# Altium project FIT_PM_Dual_Range_AFE.PrjPcb (part 5 of 8)

## Sheet ADC_PLL.SchDoc: FIT_PM12 board
size 420 x 297 mm; CheckedBy: G.Kasprowicz; Author: INR Moscow; CompanyName: WUT ISE; DrawnBy: M.Podgórski; Organization: WUT ISE; Address1: PW ISE; Address2: Nowowiejska 15/19 00-665 Warsaw; Address3: gkasprow@gmail.com; DocumentNumber: 6; Revision: 2; SheetNumber: 7; SheetTotal: 21; ModifiedBy: -; CheckedDate: -; Title2: ADC clocking; DivGrp: WUT ISE; Designer: INR RAS; ModifiedDate: -; ProjectName: Sensor Box
Used 2 times, as channels U_AFE/ADC_PLL1, U_AFE/ADC_PLL2. Parts and nets are listed once, with the designators drawn on the sheet.
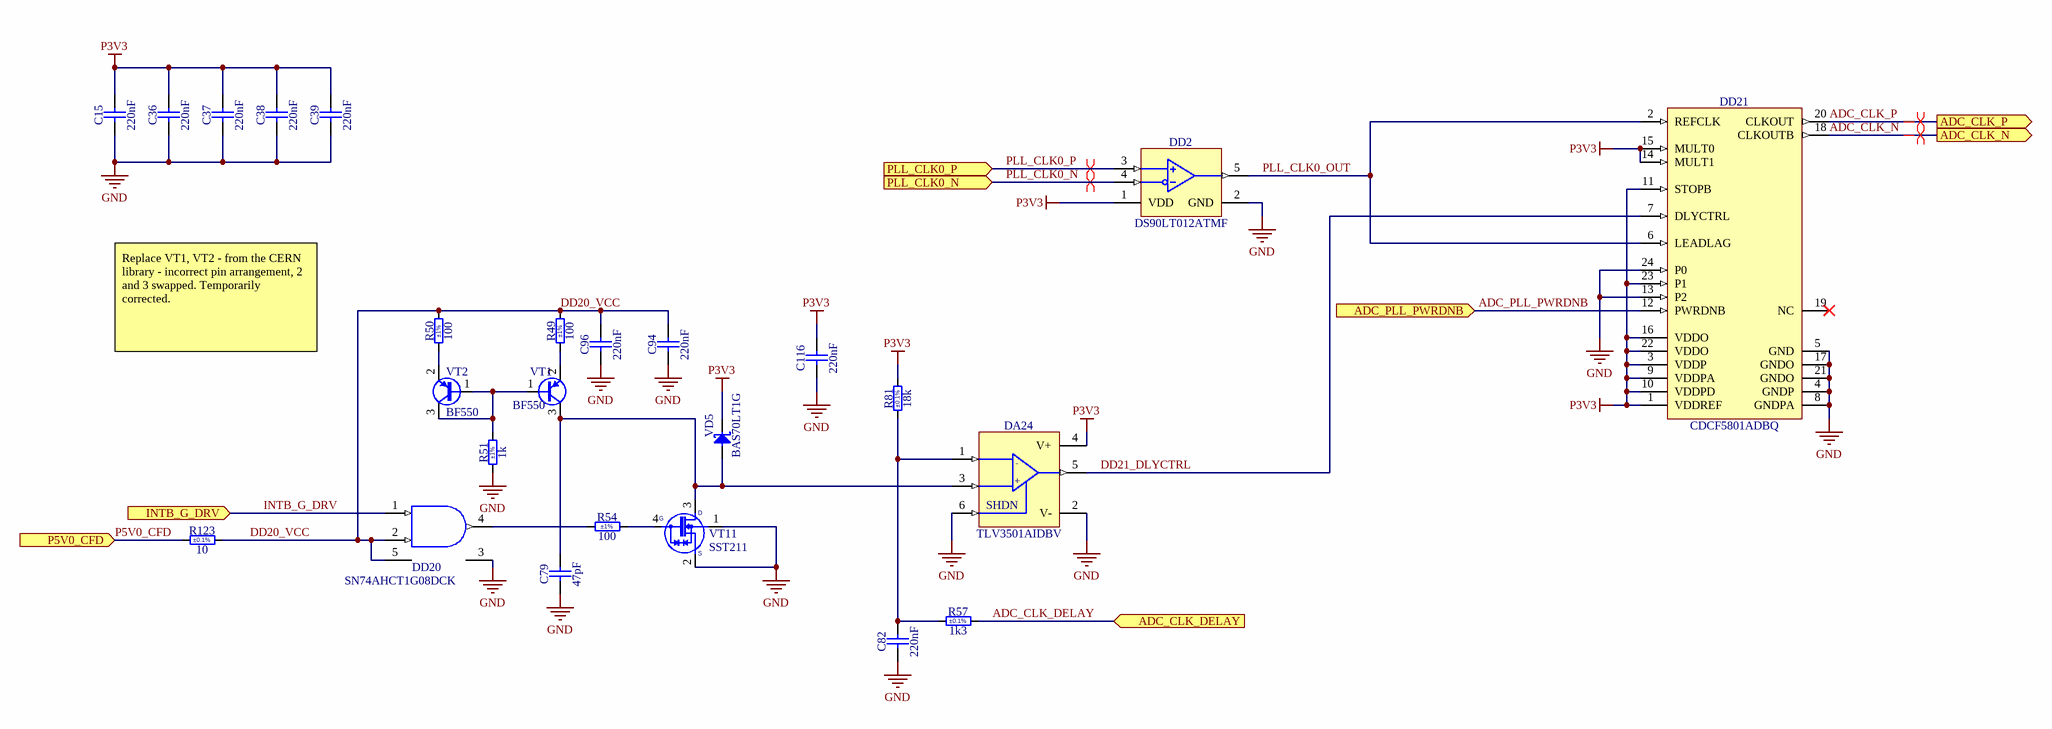
[diagram p15: ADC_PLL.SchDoc]

### Parts
C15  220nF  [CAPC1005X55N]
C36  220nF  [CAPC1005X55N]
C37  220nF  [CAPC1005X55N]
C38  220nF  [CAPC1005X55N]
C39  220nF  [CAPC1005X55N]
C79  47pF  [CAPC2012X140N]
C82  220nF  [CAPC1005X55N]
C94  220nF  [CAPC1005X55N]
C96  220nF  [CAPC1005X55N]
C116  220nF  [CAPC2012X135N]
DA24  TLV3501AIDBV  [SOT95P280X145-6N]
DD2  DS90LT012ATMF  [SOT95P280X145-5N]
DD20  SN74AHCT1G08DCK  [SOT65P210X110-5N]
DD21  CDCF5801ADBQ  [SOP63P600X175-24N]
R49  100  Tolerance: ±1%  [RESC1608X55N]
R50  100  Tolerance: ±1%  [RESC1608X55N]
R51  1k  Tolerance: ±1%  [RESC1005X40N]
R54  100  Tolerance: ±1%  [RESC1608X55N]
R57  1k3  Tolerance: ±0.1%  [RESC2012X60N]
R81  18k  Tolerance: ±0.1%  [RESC2012X60N]
R123  10  Tolerance: ±0.1%  [RESC2012X60N]
VD5  BAS70LT1G  [SOT95P240X110-3N]
VT1  BF550  [SOT95P230X110-3N]
VT2  BF550  [SOT95P230X110-3N]
VT11  SST211  [SOT143N]

### Ports
ADC_CLK_DELAY (in), ADC_CLK_N (out), ADC_CLK_P (out), ADC_PLL_PWRDNB (in), INTB_G_DRV (in), P5V0_CFD (in), PLL_CLK0_N (in), PLL_CLK0_P (in)

### Nets
GND: C15.1 C36.1 C37.1 C38.1 C39.1 C79.1 C82.1 C94.1 C96.1 C116.1 DA24.2(V-) DA24.6(SHDN) DD2.2(GND) DD20.3(GND) DD21.4(GNDP) DD21.5(GND) DD21.8(GNDPA) DD21.13(P2) DD21.17(GNDO) DD21.21(GNDO) DD21.24(P0) R51.1 VT11.1(SUB) VT11.2(S)
P3V3: C15.2 C36.2 C37.2 C38.2 C39.2 C116.2 DA24.4(V+) DD2.1(VDD) DD21.1(VDDREF) DD21.3(VDDP) DD21.9(VDDPA) DD21.10(VDDPD) DD21.11(STOPB) DD21.14(MULT1) DD21.15(MULT0) DD21.16(VDDO) DD21.22(VDDO) DD21.23(P1) R81.2 VD5.3(C)
ADC_CLK_DELAY: R57.2 ; port ADC_CLK_DELAY
ADC_CLK_N: DD21.18(CLKOUTB) ; port ADC_CLK_N
ADC_CLK_P: DD21.20(CLKOUT) ; port ADC_CLK_P
ADC_PLL_PWRDNB: DD21.12(PWRDNB) ; port ADC_PLL_PWRDNB
DD20_VCC: C94.2 C96.2 DD20.2(A) DD20.5(VCC) R49.2 R50.2 R123.2
DD21_DLYCTRL: DA24.5(OUT) DD21.7(DLYCTRL)
INTB_G_DRV: DD20.1(B) ; port INTB_G_DRV
P5V0_CFD: R123.1 ; port P5V0_CFD
PLL_CLK0_N: DD2.4(IN-) ; port PLL_CLK0_N
PLL_CLK0_OUT: DD2.5(TTLOUT) DD21.2(REFCLK) DD21.6(LEADLAG)
PLL_CLK0_P: DD2.3(IN+) ; port PLL_CLK0_P
NetC79_2: C79.2 DA24.3(+IN) VD5.1(A) VT1.3(E) VT11.3(D)
NetC82_2: C82.2 DA24.1(-IN) R57.1 R81.1
NetDD20_4: DD20.4(Y) R54.1
NetR49_1: R49.1 VT1.2(C)
NetR50_1: R50.1 VT2.2(C)
NetR51_2: R51.2 VT1.1(B) VT2.1(B) VT2.3(E)
NetR54_2: R54.2 VT11.4(G)

Not connected (* = marked no-connect by the designer): DD21 19(NC)*

### Channels
U_AFE/ADC_PLL1: designators end in A; ports ADC_CLK_DELAY=ADC_CLK_DELAY ADC_CLK_N=ADC_CLK_N ADC_CLK_P=ADC_CLK_P ADC_PLL_PWRDNB=ADC_PLL_PWRDNB INTB_G_DRV=INTB_G_DRV P5V0_CFD=P5V0_CFD PLL_CLK0_N=PLL_CLK0_N PLL_CLK0_P=PLL_CLK0_P
U_AFE/ADC_PLL2: designators end in B; ports ADC_CLK_DELAY=ADC_CLK_DELAY ADC_CLK_N=ADC_CLK_N ADC_CLK_P=ADC_CLK_P ADC_PLL_PWRDNB=ADC_PLL_PWRDNB INTB_G_DRV=INTB_G_DRV P5V0_CFD=P5V0_CFD PLL_CLK0_N=PLL_CLK0_N PLL_CLK0_P=PLL_CLK0_P

### Layout directives
differential pair: ADC_CLK_N, ADC_CLK_P, PLL_CLK0_N, PLL_CLK0_P

### Notes on the sheet
- Replace VT1, VT2 - from the CERN library - incorrect pin arrangement, 2 and 3 swapped. Temporarily corrected.
- Project/Equipment
- Document
- Designer
- Drawn by
- Check.by
- Copyright WUT ISE 2024.
  This documentation describes Open Hardware and is licensed under the CERN OHL-W v.2.0. You may redistribute and modify this documentation under the terms of the CERN OHL-W v.2.0. (http://ohwr.org/CERNOHL). This documentation is distributed WITHOUT ANY EXPRESS OR IMPLIED WARRANTY, INCLUDING OF MERCHANTABILITY, SATISFACTORY QUALITY AND FITNESS FOR A PARTICULAR PURPOSE. Please see the CERN OHL v.2.0 for applicable conditions.
- Contact
- File
- Last Mod.
- Print Date
- Sheet
- Size
- A3
- of
- Rev
- (in symbol TLV3501AIDBV) -; +

### Library data of the parts
C15 C36-C39 C82 C94 C96 = CC0402_220NF_16V_10%_X7R: Non-polarised capacitor; Part Description: SMD Multilayer Chip Ceramic Capacitor; Manufacturer: GENERIC; Manufacturer1 Part Number: C1005X7R1C224K050; Voltage: 16V; TC: X7R; Tolerance: ±10%; Part Number: CC0402_220NF_16V_10%_X7R; Component Kind: Standard; Component Type: Standard; Pin Count: 2; Value: 220nF; Status: Preferred; Manufacturer Part Number: CC0402_220NF_16V_10%_X7R; Case: 0402; Mounted: Yes; Socket: No; SMD: Yes; Sense: No; Manufacturer1 Example: TDK; Manufacturer1 ComponentHeight: 0.55mm; HelpURL: \\cern.ch\dfs\Applications\Altium\Datasheets\CC0402_X7R_TDK_C.pdf; Author: CERN DEM JLC; CreateDate: 25.10.2012; LatestRevisionDate: 25.10.2012
C79 = CC0805_47pF_50V_2%_X8R: Non-polarised capacitor; Part Description: SMD Multilayer Chip Ceramic Capacitor (Automotive Grade); Manufacturer: KEMET; Manufacturer Part Number: C0805C470G5HACAUTO; Voltage: 50V; TC: X8R; Tolerance: ±2%; Part Number: CC0805_47pF_50V_2%_X8R; Component Kind: Standard; Component Type: Standard; Pin Count: 2; Value: 47pF; Status: Not Recommended; Case: 0805; Mounted: Yes; Socket: No; SMD: Yes; Sense: No; ComponentHeight: 1.4mm; HelpURL: \\cern.ch\dfs\Applications\Altium\Datasheets\CC0805_X8R_KEMET.pdf; Author: CERN DEM HF; CreateDate: 07.05.2024; LatestRevisionDate: 07.05.2024
C116 = CC0805_220NF_50V_10%_X7R: Non-polarised capacitor; Part Description: SMD Multilayer Chip Ceramic Capacitor; Manufacturer: GENERIC; Manufacturer1 Part Number: GRM21BR71H224KA01L; Voltage: 50V; TC: X7R; Tolerance: ±10%; Part Number: CC0805_220NF_50V_10%_X7R; Component Kind: Standard; Component Type: Standard; Pin Count: 2; Value: 220nF; Status: Preferred; Manufacturer Part Number: CC0805_220NF_50V_10%_X7R; Case: 0805; Mounted: Yes; Socket: No; SMD: Yes; Sense: No; Manufacturer1 Example: MURATA; Manufacturer1 ComponentHeight: 1.35mm; HelpURL: \\cern.ch\dfs\Applications\Altium\Datasheets\CC0805_X7R_MURATA.pdf; Author: CERN DEM JLC; CreateDate: 03.12.2007; LatestRevisionDate: 03.12.2007
DA24 = TLV3501AIDBV: Wideband, Fixed Gain, Video Buffer Amplifier With Disable; Part Description: 4.5-ns, Rail-to-Rail, High-Speed Comparator; Manufacturer: TEXAS INSTRUMENTS; PressFit: No; Bonding: No; Part Number: TLV3501AIDBV; Component Kind: Standard; Component Type: Standard; Device: TLV3501AIDBV; PackageDescription: SOT, 0.95mm Pitch; 6 Pin, 1.60mm W X 2.90mm L X 1.45mm H body, IPC Medium Density; Manufacturer Part Number: TLV3501AIDBV; Pin Count: 6; Case: SOT23-6; Mounted: Yes; Socket: No; SMD: Yes; Sense: No; ComponentHeight: 1.45mm; Author: CERN DEM HF; HelpURL: \\cern.ch\dfs\Applications\Altium\Datasheets\TLV3501.pdf; CreateDate: 17.05.2024; LatestRevisionDate: 17.05.2024
DD2 = DS90LT012ATMF: 3V LVDS Single CMOS Differential Line Receiver; Manufacturer: TEXAS INSTRUMENTS; PressFit: No; Bonding: No; Part Number: DS90LT012ATMF; Component Kind: Standard; Component Type: Standard; Device: DS90LT012ATMF; PackageDescription: SOT, 0.95mm Pitch; 5 Pin, 1.60mm W X 2.90mm L X 1.45mm H body, IPC Medium Density; Part Description: 3V LVDS Single CMOS Differential Line Receiver; Manufacturer Part Number: DS90LT012ATMF; Pin Count: 5; Case: SOT23-5; Mounted: Yes; Socket: No; SMD: Yes; Sense: No; ComponentHeight: 1.45mm; Author: CERN DEM HF; HelpURL: \\cern.ch\dfs\Applications\Altium\Datasheets\DS90LT012ATMF.pdf; CreateDate: 08.05.2024; LatestRevisionDate: 08.05.2024
DD20 = SN74AHCT1G08DCK: Single 2-Input AND Gate; Part Description: Single 2-Input Positive-AND Gate; Manufacturer: TEXAS INSTRUMENTS; PressFit: No; Bonding: No; Part Number: SN74AHCT1G08DCK; Component Kind: Standard; Component Type: Standard; Device: SN74AHCT1G08DCK; PackageDescription: SOT353, SC70-5, 0.65mm Pitch; 5 Pin, 1.25mm W X 2.00mm L X 1.10mm H body, IPC Medium Density; Manufacturer Part Number: SN74AHCT1G08DCK; Pin Count: 5; Case: SOT353; Mounted: Yes; Socket: No; SMD: Yes; Sense: No; ComponentHeight: 1.1mm; Author: CERN DEM HF; HelpURL: \\cern.ch\dfs\Applications\Altium\Datasheets\NC7SZ08.pdf; CreateDate: 17.05.2024; LatestRevisionDate: 17.05.2024
DD21 = CDCF5801ADBQ: Clock Multiplier with Delay Control and Phase Alignment; Manufacturer: TEXAS INSTRUMENTS; PressFit: No; Bonding: No; Part Number: CDCF5801ADBQ; Component Kind: Standard; Component Type: Standard; Device: CDCF5801ADBQ; PackageDescription: SOP, 0.635mm Pitch; 24 Pin, 3.90mm W X 8.65mm L X 1.75mm H Body, IPC Medium Density; Part Description: Clock Multiplier with Delay Control and Phase Alignment; Manufacturer Part Number: CDCF5801ADBQ; Pin Count: 24; Case: SSOP24; Mounted: Yes; Socket: No; SMD: Yes; Sense: No; ComponentHeight: 1.75mm; HelpURL: \\cern.ch\dfs\Applications\Altium\Datasheets\CDCF5801A.pdf; Author: CERN DEM HF; CreateDate: 07.05.2024; LatestRevisionDate: 07.05.2024
R49 R50 R54 = R0603_100R_1%_0.1W_100PPM: Resistor - 1%; Part Description: General Purpose Thick Film Chip Resistor; Manufacturer: GENERIC; Manufacturer1 Part Number: NRC06F4700TRF; Power: 0.1W; TC: ±100ppm/°C; PressFit: No; Part Number: R0603_100R_1%_0.1W_100PPM; Component Kind: Standard; Component Type: Standard; Pin Count: 2; Value: 100; Status: Preferred; Manufacturer Part Number: R0603_100R_1%_0.1W_100PPM; Case: 0603; Mounted: Yes; Sense: No; Socket: No; SMD: Yes; Manufacturer1 Example: NIC COMPONENT; Manufacturer1 ComponentHeight: 0.55mm; HelpURL: \\cern.ch\dfs\Applications\Altium\Datasheets\R0603_NIC_NRC.pdf; Author: CERN DEM JLC; CreateDate: 03.12.2007; LatestRevisionDate: 13.03.2008
R51 = R0402_1K_1%_0.0625W_100PPM: Resistor - 1%; Part Description: General Purpose Thick Film Chip Resistor; Manufacturer: GENERIC; Manufacturer1 Part Number: 232270671002L; TC: ±100ppm/°C; PressFit: No; Part Number: R0402_1K_1%_0.0625W_100PPM; Component Kind: Standard; Component Type: Standard; Pin Count: 2; Value: 1k; Status: Not Recommended; Power: 0.0625W; Manufacturer Part Number: R0402_1K_1%_0.0625W_100PPM; Case: 0402; Mounted: Yes; Sense: No; Socket: No; SMD: Yes; Manufacturer1 Example: YAGEO PHYCOMP; Manufacturer1 ComponentHeight: 0.4mm; HelpURL: \\cern.ch\dfs\Applications\Altium\Datasheets\R0402_Phycomp_RC0402.pdf; Author: CERN DEM JLC; CreateDate: 03.12.2007; LatestRevisionDate: 17.10.2012
R57 = R0805_1K3_0.1%_0.1W_10PPM: Resistor - 0.1%; Part Description: Thin Film Chip Resistor; Manufacturer: GENERIC; Manufacturer1 Part Number: RN73C2A1K3BTG; Power: 0.1W; TC: ±10ppm; PressFit: No; Part Number: R0805_1K3_0.1%_0.1W_10PPM; Component Kind: Standard; Component Type: Standard; Pin Count: 2; Value: 1k3; Status: Not Recommended; Manufacturer Part Number: R0805_1K3_0.1%_0.1W_10PPM; Case: 0805; Mounted: Yes; Sense: No; Socket: No; SMD: Yes; Manufacturer1 Example: TYCO HOLSWORTHY; Manufacturer1 ComponentHeight: 0.6mm; HelpURL: \\cern.ch\dfs\Applications\Altium\Datasheets\R0805_Tyco_RN73.pdf; Author: CERN DEM JLC; CreateDate: 03.12.2007; LatestRevisionDate: 13.03.2008
R81 = R0805_18K_0.1%_0.125W_10PPM: Resistor - 0.1%; Part Description: Thin Film Chip Resistor; Manufacturer: GENERIC; Manufacturer1 Part Number: ERA6ARB183V; Power: 0.125W; TC: ±10ppm; PressFit: No; Part Number: R0805_18K_0.1%_0.125W_10PPM; Component Kind: Standard; Component Type: Standard; Pin Count: 2; Value: 18k; Status: Not Recommended; Manufacturer Part Number: R0805_18K_0.1%_0.125W_10PPM; Case: 0805; Mounted: Yes; Sense: No; Socket: No; SMD: Yes; Manufacturer1 Example: PANASONIC; Manufacturer1 ComponentHeight: 0.6mm; HelpURL: \\cern.ch\dfs\Applications\Altium\Datasheets\R0805_PANASONIC_ERA.pdf; Author: CERN DEM HF; CreateDate: 17.05.2024; LatestRevisionDate: 17.05.2024
R123 = R0805_10R_0.1%_0.1W_10PPM: Resistor - 0.1%; Part Description: Thin Film Chip Resistor; Manufacturer: GENERIC; Manufacturer1 Part Number: RN73C2A10RBTG; Power: 0.1W; TC: ±10ppm; PressFit: No; Part Number: R0805_10R_0.1%_0.1W_10PPM; Component Kind: Standard; Component Type: Standard; Pin Count: 2; Value: 10; Status: Not Recommended; Manufacturer Part Number: R0805_10R_0.1%_0.1W_10PPM; Case: 0805; Mounted: Yes; Sense: No; Socket: No; SMD: Yes; Manufacturer1 Example: TYCO HOLSWORTHY; Manufacturer1 ComponentHeight: 0.6mm; HelpURL: \\cern.ch\dfs\Applications\Altium\Datasheets\R0805_Tyco_RN73.pdf; Author: CERN DEM JLC; CreateDate: 03.12.2007; LatestRevisionDate: 13.03.2008
VD5 = BAS70LT1G: Diode Schottky  Anode Pin 1 Cathode Pin 3 (Pas de pin 2); Part Description: Schottky Barrier Diode; Manufacturer: ON SEMICONDUCTOR; Manufacturer Part Number: BAS70L; Voltage: 70V; Power: 70mA; PressFit: No; Bonding: No; Part Number: BAS70LT1G; Component Kind: Standard; Component Type: Standard; Device: BAS70LT1G; PackageDescription: SOT, 0.95mm Pitch; 3 Pin, 1.30mm W X 2.90mm L X 1.10mm H body, IPC Medium Density; Pin Count: 3; Case: SOT23-3; Mounted: Yes; Socket: No; SMD: Yes; Sense: No; ComponentHeight: 1.1mm; HelpURL: \\cern.ch\dfs\Applications\Altium\Datasheets\BAS70LT1G.pdf; Author: CERN DEM JLC; CreateDate: 11.09.2018; LatestRevisionDate: 24.05.2022
VT1 VT2 = BF550: PNP Transistor; Part Description: 40V 25mA PNP Medium Frequency Transistor; Manufacturer: NXP SEMICONDUCTORS; PressFit: No; Bonding: No; Part Number: BF550; Component Kind: Standard; Component Type: Standard; Device: BF550; PackageDescription: SOT23, 0.95mm Pitch; 3 Pin, 1.30mm W X 2.90mm L X 1.10mm H body, IPC Medium Density; Manufacturer Part Number: BF550; Pin Count: 3; Case: SOT23-3; Mounted: Yes; Socket: No; SMD: Yes; Sense: No; ComponentHeight: 1.1mm; HelpURL: \\cern.ch\dfs\Applications\Altium\Datasheets\BF550.pdf; Author: CERN DEM HF; CreateDate: 06.05.2024; LatestRevisionDate: 06.05.2024
VT11 = SST211: 30V, 50 mA N-Channel Enhancement Switching Transistor; Part Description: 30V, 50mA, N-Channel Enhancement Switching Transistor; Manufacturer: Linear Systems; PressFit: No; Bonding: No; Part Number: SST211; Component Kind: Standard; Component Type: Standard; Device: SST211; PackageDescription: SOT143, 4-Leads, Body 3.0x2.6mm (max), Pitch 1.92mm, IPC Medium Density; Status: Obsolete; Manufacturer Part Number: SST211; Pin Count: 4; Case: SOT143; Mounted: Yes; Socket: No; SMD: Yes; Sense: No; ComponentHeight: 1.3mm; HelpURL: \\cern.ch\dfs\Applications\Altium\Datasheets\BSS83,215.pdf; Author: CERN DEM JLC; CreateDate: 01.07.2014; LatestRevisionDate: 17.05.2016

## Sheet Gate_Strobe.SchDoc: FIT_PM12 board
size 420 x 297 mm; CheckedBy: G.Kasprowicz; Author: INR Moscow; CompanyName: WUT ISE; DrawnBy: M.Podgórski; Organization: WUT ISE; Address1: PW ISE; Address2: Nowowiejska 15/19 00-665 Warsaw; Address3: gkasprow@gmail.com; DocumentNumber: 5; Revision: 2; SheetNumber: 9; SheetTotal: 21; ModifiedBy: -; CheckedDate: -; Title2: INT gate strobe; DivGrp: WUT ISE; Designer: INR RAS; ModifiedDate: -; ProjectName: Sensor Box
Used 2 times, as channels U_AFE/Gate_Strobe1, U_AFE/Gate_Strobe2. Parts and nets are listed once, with the designators drawn on the sheet.
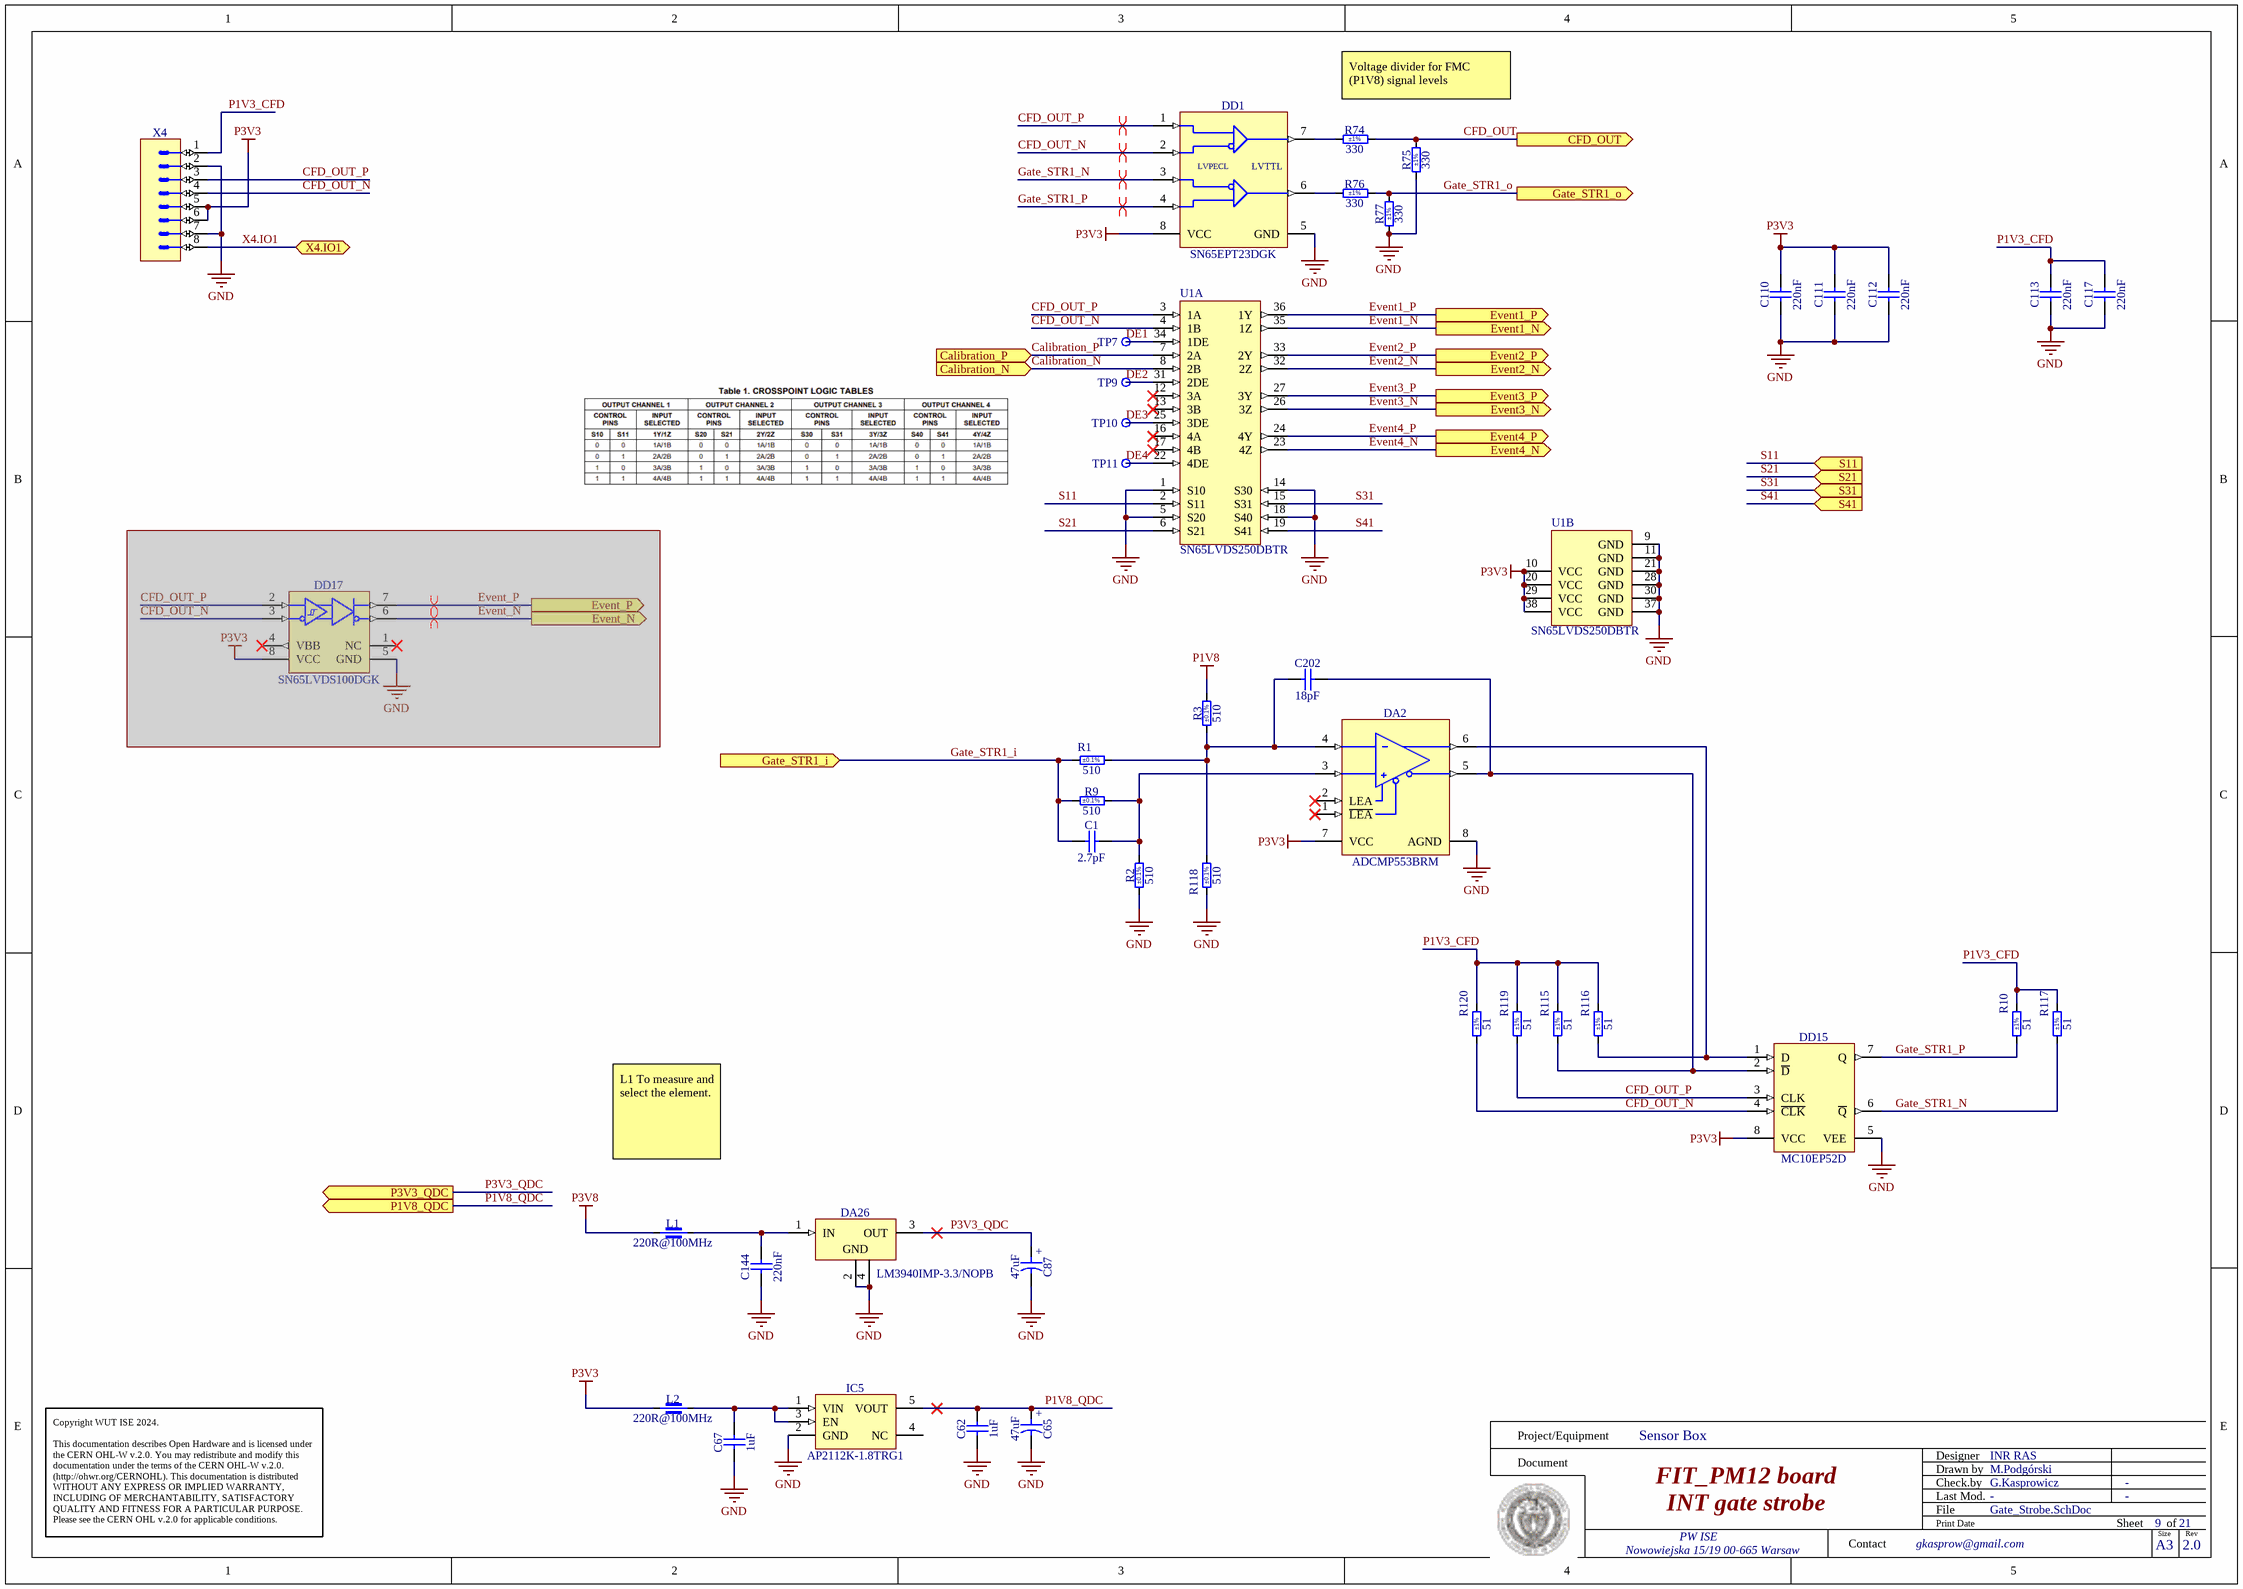
[diagram p16: Gate_Strobe.SchDoc]

### Parts
C1  2.7pF  [CAPC2012X135N]
C62  1uF  [CAPC2012X140N]
C65  47uF  [CAPAE530X610N]
C67  1uF  [CAPC2012X140N]
C87  47uF  [CAPAE530X610N]
C110  220nF  [CAPC1005X55N]
C111  220nF  [CAPC1005X55N]
C112  220nF  [CAPC1005X55N]
C113  220nF  [CAPC1005X55N]
C117  220nF  [CAPC1005X55N]
C144  220nF  [CAPC2012X135N]
C202  18pF  [CAPC2012X88N]
DA2  ADCMP553BRM  [SOP65P490X110-8N]
DA26  LM3940IMP-3.3/NOPB  [SOT230P700X180-4N]
DD1  SN65EPT23DGK  [SOP65P490X110-8N]
DD15  MC10EP52D  [SOIC127P600X175-8N]
DD17  SN65LVDS100DGK  [SOP65P490X110-8N]  (masked out: inside a compile mask, not in the netlist)
IC5  AP2112K-1.8TRG1  [SOT95P285X140-5N]
L1  220R@100MHz  [INDC2012X105N]
L2  220R@100MHz  [INDC2012X105N]
R1  510  Tolerance: ±0.1%  [RESC2012X60N]
R2  510  Tolerance: ±0.1%  [RESC2012X60N]
R3  510  Tolerance: ±0.1%  [RESC2012X60N]
R9  510  Tolerance: ±0.1%  [RESC2012X60N]
R10  51  Tolerance: ±1%  [RESC2012X60N]
R74  330  Tolerance: ±1%  [RESC1005X40N]
R75  330  Tolerance: ±1%  [RESC1005X40N]
R76  330  Tolerance: ±1%  [RESC1005X40N]
R77  330  Tolerance: ±1%  [RESC1005X40N]
R115  51  Tolerance: ±1%  [RESC2012X60N]
R116  51  Tolerance: ±1%  [RESC2012X60N]
R117  51  Tolerance: ±1%  [RESC2012X60N]
R118  510  Tolerance: ±0.1%  [RESC2012X60N]
R119  51  Tolerance: ±1%  [RESC2012X60N]
R120  51  Tolerance: ±1%  [RESC2012X60N]
TP7  SMD Pad  [C60]  (value not drawn)
TP9  SMD Pad  [C60]  (value not drawn)
TP10  SMD Pad  [C60]  (value not drawn)
TP11  SMD Pad  [C60]  (value not drawn)
U1  SN65LVDS250DBTR  [DBT0038A_M]  (parts A,B of 2)
X4  Header 8  [SAMTEC_DW-08-09-L-S-470]  (value not drawn)

### Ports
Calibration_N (in), Calibration_P (in), CFD_OUT (out), Event1_N (out), Event1_P (out), Event2_N (out), Event2_P (out), Event3_N (out), Event3_P (out), Event4_N (out), Event4_P (out), Event_N (out), Event_P (out), Gate_STR1_i (in), Gate_STR1_o (out), P1V8_QDC (out), P3V3_QDC (out), S11 (in), S21 (in), S31 (in), S41 (in), X4.IO1 (bidir)

### Nets
GND: C62.1 C65.2 C67.1 C87.2 C110.1 C111.1 C112.1 C113.1 C117.1 C144.1 DA2.8(AGND) DA26.2(GND) DA26.4(GND) DD1.5(GND) DD15.5(VEE) IC5.2(GND) R2.1 R75.1 R77.1 R118.1 U1.1(S10) U1.5(S20) U1.9(GND) U1.11(GND) U1.14(S30) U1.18(S40) U1.21(GND) U1.28(GND) U1.30(GND) U1.37(GND) X4.2 X4.7
P1V8: R3.2
P3V3: C110.2 C111.2 C112.2 DA2.7(VCC) DD1.8(VCC) DD15.8(VCC) L2.1 U1.10(VCC) U1.20(VCC) U1.29(VCC) U1.38(VCC) X4.5 X4.6
P3V8: L1.1
Calibration_N: U1.8(2B) ; port Calibration_N
Calibration_P: U1.7(2A) ; port Calibration_P
CFD_OUT: R74.2 R75.2 ; port CFD_OUT
CFD_OUT_N: DD1.2(~{D0}) DD15.4(~{CLK}) R120.1 U1.4(1B) X4.4
CFD_OUT_P: DD1.1(D0) DD15.3(CLK) R119.1 U1.3(1A) X4.3
DE1: TP7.1 U1.34(1DE)
DE2: TP9.1 U1.31(2DE)
DE3: TP10.1 U1.25(3DE)
DE4: TP11.1 U1.22(4DE)
Event1_N: U1.35(1Z) ; port Event1_N
Event1_P: U1.36(1Y) ; port Event1_P
Event2_N: U1.32(2Z) ; port Event2_N
Event2_P: U1.33(2Y) ; port Event2_P
Event3_N: U1.26(3Z) ; port Event3_N
Event3_P: U1.27(3Y) ; port Event3_P
Event4_N: U1.23(4Z) ; port Event4_N
Event4_P: U1.24(4Y) ; port Event4_P
Gate_STR1_i: C1.1 R1.1 R9.1 ; port Gate_STR1_i
Gate_STR1_N: DD1.3(~{D1}) DD15.6(~{Q}) R117.1
Gate_STR1_o: R76.2 R77.2 ; port Gate_STR1_o
Gate_STR1_P: DD1.4(D1) DD15.7(Q) R10.1
P1V3_CFD: C113.2 C117.2 R10.2 R115.2 R116.2 R117.2 R119.2 R120.2 X4.1
P1V8_QDC: C62.2 C65.1 IC5.5(VOUT) ; port P1V8_QDC
P3V3_QDC: C87.1 DA26.3(OUT) ; port P3V3_QDC
S11: U1.2(S11) ; port S11
S21: U1.6(S21) ; port S21
S31: U1.15(S31) ; port S31
S41: U1.19(S41) ; port S41
X4.IO1: X4.8 ; port X4.IO1
NetC1_2: C1.2 DA2.3(+INA) R2.2 R9.2
NetC67_2: C67.2 IC5.1(VIN) IC5.3(EN) L2.2
NetC144_2: C144.2 DA26.1(IN) L1.2
NetC202_1: C202.1 DA2.4(-INA) R1.2 R3.1 R118.2
NetC202_2: C202.2 DA2.5(~{QA}) DD15.2(~{D}) R115.1
NetDA2_6: DA2.6(QA) DD15.1(D) R116.1
NetDD1_6: DD1.6(Q1) R76.1
NetDD1_7: DD1.7(Q0) R74.1

Not connected (* = marked no-connect by the designer): DA2 1(~{LEA})* 2(LEA)*; IC5 4(NC); U1 12(3A)* 13(3B)* 16(4A)* 17(4B)*

### Channels
U_AFE/Gate_Strobe1: designators end in A; ports Calibration_N=Calibration_N_Gate_Strobe1 Calibration_P=Calibration_P_Gate_Strobe1 CFD_OUT=CFD_OUT_Gate_Strobe1 Event1_N=Event1_N_Gate_Strobe1 Event1_P=Event1_P_Gate_Strobe1 Event2_N=Event2_N_Gate_Strobe1 Event2_P=Event2_P_Gate_Strobe1 Event3_N=Event3_N_Gate_Strobe1 Event3_P=Event3_P_Gate_Strobe1 Event4_N=Event4_N_Gate_Strobe1 Event4_P=Event4_P_Gate_Strobe1 Gate_STR1_i=Gate_STR1_i_Gate_Strobe1 Gate_STR1_o=Gate_STR1_o_Gate_Strobe1 P1V8_QDC=P1V8_QDC P3V3_QDC=P3V3_QDC S11=S11_Gate_Strobe1 S21=S21_Gate_Strobe1 S31=S31_Gate_Strobe1 S41=S41_Gate_Strobe1 X4.IO1=X4.IO1_Gate_Strobe1
U_AFE/Gate_Strobe2: designators end in B; ports Calibration_N=Calibration_N_Gate_Strobe2 Calibration_P=Calibration_P_Gate_Strobe2 CFD_OUT=CFD_OUT_Gate_Strobe2 Event1_N=Event1_N_Gate_Strobe2 Event1_P=Event1_P_Gate_Strobe2 Event2_N=Event2_N_Gate_Strobe2 Event2_P=Event2_P_Gate_Strobe2 Event3_N=Event3_N_Gate_Strobe2 Event3_P=Event3_P_Gate_Strobe2 Event4_N=Event4_N_Gate_Strobe2 Event4_P=Event4_P_Gate_Strobe2 Gate_STR1_i=Gate_STR1_i_Gate_Strobe2 Gate_STR1_o=Gate_STR1_o_Gate_Strobe2 P1V8_QDC=P1V8_QDC P3V3_QDC=P3V3_QDC S11=S11_Gate_Strobe2 S21=S21_Gate_Strobe2 S31=S31_Gate_Strobe2 S41=S41_Gate_Strobe2 X4.IO1=X4.IO1_Gate_Strobe2

### Layout directives
differential pair; differential pair class D100: (no net found under the mark), CFD_OUT_N_Gate_Strobe1, CFD_OUT_P_Gate_Strobe1, Gate_STR1_N_Gate_Strobe1, Gate_STR1_P_Gate_Strobe1

### Notes on the sheet
- Voltage divider for FMC (P1V8) signal levels
- L1 To measure and select the element.
- Project/Equipment
- Document
- Designer
- Drawn by
- Check.by
- Copyright WUT ISE 2024.
  This documentation describes Open Hardware and is licensed under the CERN OHL-W v.2.0. You may redistribute and modify this documentation under the terms of the CERN OHL-W v.2.0. (http://ohwr.org/CERNOHL). This documentation is distributed WITHOUT ANY EXPRESS OR IMPLIED WARRANTY, INCLUDING OF MERCHANTABILITY, SATISFACTORY QUALITY AND FITNESS FOR A PARTICULAR PURPOSE. Please see the CERN OHL v.2.0 for applicable conditions.
- Contact
- File
- Last Mod.
- Print Date
- Sheet
- Size
- A3
- of
- Rev
- (in symbol CAE530-610_47UF_16V_20%) +
- (in symbol SN65EPT23DGK) LVPECL; LVTTL

### Library data of the parts
C1 = CC0805_2.7PF_250V_0.05PF_NP0: Non-polarised capacitor; Part Description: SMD Multilayer Chip Ceramic Capacitor; Manufacturer: GENERIC; Manufacturer1 Part Number: 600F2R7AT250XT; Voltage: 50V; TC: C0G/NP0; Tolerance: ±0.05pF; Part Number: CC0805_2.7PF_250V_0.05PF_NP0; Component Kind: Standard; Component Type: Standard; Pin Count: 2; Value: 2.7pF; Status: None; Manufacturer Part Number: CC0805_2.7PF_250V_0.05PF_NP0; Case: 0805; Mounted: Yes; Socket: No; SMD: Yes; Sense: No; Manufacturer1 Example: AVX; Manufacturer1 ComponentHeight: 1.30mm; HelpURL: \\cern.ch\dfs\Applications\Altium\Datasheets\CC0805_NP0_AVX(MLC).pdf; Author: CERN DEM HF; CreateDate: 07.05.2024; LatestRevisionDate: 07.05.2024
C62 C67 = CC0805_1UF_25V_10%_X7R: Non-polarised capacitor; Part Description: SMD Multilayer Chip Ceramic Capacitor; Manufacturer: GENERIC; Manufacturer1 Part Number: C0805C105K3RAC; Voltage: 25V; TC: X7R; Tolerance: ±10%; Part Number: CC0805_1UF_25V_10%_X7R; Component Kind: Standard; Component Type: Standard; Pin Count: 2; Value: 1uF; Status: Preferred; Manufacturer Part Number: CC0805_1UF_25V_10%_X7R; Case: 0805; Mounted: Yes; Socket: No; SMD: Yes; Sense: No; Manufacturer1 Example: KEMET; Manufacturer1 ComponentHeight: 1.4mm; HelpURL: \\cern.ch\dfs\Applications\Altium\Datasheets\CC0805_X7R_KEMET.pdf; Author: CERN DEM JLC; CreateDate: 23.03.2009; LatestRevisionDate: 23.03.2009
C65 C87 = CAE530-610_47UF_16V_20%: Polarised capacitor; Part Description: Conductive Polymer Hybrid Aluminum Electrolytic Capacitor; Manufacturer: CHEMI-CON; Manufacturer Part Number: HHXD160ARA470ME61G; Voltage: 16V; Tolerance: ±20%; Part Number: CAE530-610_47UF_16V_20%; Component Kind: Standard; Component Type: Standard; Pin Count: 2; Value: 47uF; Status: Not Recommended; Case: C; Mounted: Yes; Socket: No; SMD: Yes; Sense: No; ComponentHeight: 6.1mm; HelpURL: \\cern.ch\dfs\Applications\Altium\Datasheets\CAE_CHIMI-CON_HXD.pdf; Author: CERN DEM HF; CreateDate: 15.04.2024; LatestRevisionDate: 15.04.2024
C110-C113 C117 = CC0402_220NF_16V_10%_X7R: as C15 on sheet ADC_PLL; Part Number: CC0402_220NF_16V_10%_X7R; Component Kind: Standard; Component Type: Standard; Pin Count: 2; Value: 220nF; Status: Preferred; Manufacturer Part Number: CC0402_220NF_16V_10%_X7R; Case: 0402; Mounted: Yes; Socket: No; SMD: Yes; Sense: No; Manufacturer1 Example: TDK; Manufacturer1 ComponentHeight: 0.55mm; HelpURL: \\cern.ch\dfs\Applications\Altium\Datasheets\CC0402_X7R_TDK_C.pdf; Author: CERN DEM JLC; CreateDate: 25.10.2012; LatestRevisionDate: 25.10.2012
C144 = CC0805_220NF_50V_10%_X7R: as C116 on sheet ADC_PLL; Part Number: CC0805_220NF_50V_10%_X7R; Component Kind: Standard; Component Type: Standard; Pin Count: 2; Value: 220nF; Status: Preferred; Manufacturer Part Number: CC0805_220NF_50V_10%_X7R; Case: 0805; Mounted: Yes; Socket: No; SMD: Yes; Sense: No; Manufacturer1 Example: MURATA; Manufacturer1 ComponentHeight: 1.35mm; HelpURL: \\cern.ch\dfs\Applications\Altium\Datasheets\CC0805_X7R_MURATA.pdf; Author: CERN DEM JLC; CreateDate: 03.12.2007; LatestRevisionDate: 03.12.2007
C202 = CC0805_18PF_50V_1%_C0G: Non-polarised capacitor; Part Description: SMD Multilayer Chip Ceramic Capacitor; Manufacturer: GENERIC; Manufacturer1 Part Number: C0805C180F5GACTU; Voltage: 50V; TC: C0G/NP0; Tolerance: ±1%; Part Number: CC0805_18PF_50V_1%_C0G; Component Kind: Standard; Component Type: Standard; Pin Count: 2; Value: 18pF; Status: None; Manufacturer Part Number: CC0805_18PF_50V_1%_C0G; Case: 0805; Mounted: Yes; Socket: No; SMD: Yes; Sense: No; Manufacturer1 Example: KEMET; Manufacturer1 ComponentHeight: 0.88mm; HelpURL: \\cern.ch\dfs\Applications\Altium\Datasheets\CC0805_C0G_KEMET_(Commercial Grade).pdf; Author: CERN DEM JLC; CreateDate: 27.01.2015; LatestRevisionDate: 27.01.2015
DA2 = ADCMP553BRM: Single-Supply, High Speed PECL/LVPECL Comparators; Part Description: Single-Supply, High Speed, PECL/LVPECL Comparators; Manufacturer: ANALOG DEVICES; PressFit: No; Bonding: No; Part Number: ADCMP553BRM; Component Kind: Standard; Component Type: Standard; Device: ADCMP553BRM; PackageDescription: SOP, 0.65mm Pitch; 8 Pin, 3.00mm W X 3.00mm L X 1.10mm H body, IPC Medium Density; Manufacturer Part Number: ADCMP553BRM; Pin Count: 8; Case: MSOP8; Mounted: Yes; Socket: No; SMD: Yes; Sense: No; ComponentHeight: 1.1mm; Author: CERN DEM HF; HelpURL: \\cern.ch\dfs\Applications\Altium\Datasheets\ADCMP553.pdf; CreateDate: 06.05.2024; LatestRevisionDate: 06.05.2024
DA26 = LM3940IMP-3.3/NOPB: 3-Terminal Regulator 1=IN 2=GND 3=OUT 4=GND; Part Description: 1A Low Dropout Regulator for 5V to 3.3V Conversion; Manufacturer: TEXAS INSTRUMENTS; PressFit: No; Bonding: No; Part Number: LM3940IMP-3.3/NOPB; Component Kind: Standard; Component Type: Standard; Device: LM3940IMP-3.3/NOPB; PackageDescription: SOT223, 2.30mm Pitch; 4 Pin, 3.70mm W X 6.70mm L X 1.80mm H body, IPC Medium Density; Manufacturer Part Number: LM3940IMP-3.3; Pin Count: 4; Case: SOT223; Mounted: Yes; Socket: No; SMD: Yes; Sense: No; ComponentHeight: 1.8mm; HelpURL: \\cern.ch\dfs\Applications\Altium\Datasheets\LM3940IMP-3.3-NOPB.pdf; Author: CERN DEM JLC; CreateDate: 28.03.2011; LatestRevisionDate: 01.06.2022
DD1 = SN65EPT23DGK: 5V PECL to TTL Translator; Part Description: 3.3V ECL Differential LVPECL/LVDS to LVTTL/LVCMOS Translator; Manufacturer: TEXAS INSTRUMENTS; PressFit: No; Bonding: No; Part Number: SN65EPT23DGK; Component Kind: Standard; Component Type: Standard; Device: SN65EPT23DGK; PackageDescription: SOP, 0.65mm Pitch; 8 Pin, 3.00mm W X 3.00mm L X 1.10mm H body, IPC Medium Density; Manufacturer Part Number: SN65EPT23DGK; Pin Count: 8; Case: TSSOP8; Mounted: Yes; Socket: No; SMD: Yes; Sense: No; ComponentHeight: 1.1mm; Author: CERN DEM HF; HelpURL: \\cern.ch\dfs\Applications\Altium\Datasheets\SN65EPT23.pdf; CreateDate: 17.05.2024; LatestRevisionDate: 17.05.2024
DD15 = MC10EP52D: 3.3V/5V ECL Differential Data and Clock D Flip-Flop; Manufacturer: ON SEMICONDUCTOR; PressFit: No; Bonding: No; Part Number: MC10EP52D; Component Kind: Standard; Component Type: Standard; Device: MC10EP52D; PackageDescription: SOIC 8, Pitch 1.27mm - Body 4x5mm, IPC Medium Density; Part Description: 3.3V/5V ECL Differential Data and Clock D Flip-Flop; Manufacturer Part Number: MC10EP52D; Pin Count: 8; Case: SOIC8; Mounted: Yes; Socket: No; SMD: Yes; Sense: No; ComponentHeight: 1.75mm; Author: CERN DEM HF; HelpURL: \\cern.ch\dfs\Applications\Altium\Datasheets\MC10EP52D.pdf; CreateDate: 08.05.2024; LatestRevisionDate: 08.05.2024
DD17 = SN65LVDS100DGK: Differential LVDS Translator/Repeater; Part Description: 2Gbps Differential LVDS Translator/Repeater; Manufacturer: TEXAS INSTRUMENTS; PressFit: No; Bonding: No; Part Number: SN65LVDS100DGK; Component Kind: Standard; Component Type: Standard; Device: SN65LVDS100DGK; PackageDescription: SOP, 0.65mm Pitch; 8 Pin, 3.00mm W X 3.00mm L X 1.10mm H body, IPC Medium Density; Manufacturer Part Number: SN65LVDS100DGK; Pin Count: 8; Case: SSOP8; Mounted: Yes; Socket: No; SMD: Yes; Sense: No; ComponentHeight: 1.1mm; Author: CERN DEM JLC; HelpURL: \\cern.ch\dfs\Applications\Altium\Datasheets\SN65LVDS100DGK.pdf; CreateDate: 18.11.2011; LatestRevisionDate: 18.11.2011
IC5 = AP2112K-1.8TRG1: 600mA CMOS Low Dropout Linear Regulator with Enable; Part Description: 1.8V 600mA CMOS Low Dropout Linear Regulator with Enable; Manufacturer: DIODES INCORPORATED; PressFit: No; Bonding: No; Part Number: AP2112K-1.8TRG1; Component Kind: Standard; Component Type: Standard; Device: AP2112K-1.8TRG1; PackageDescription: SOT23, 0.95mm Pitch; 5 Pin, 1.6mm W X 3.0mm L X 1.40mm H body, IPC Medium Density; Manufacturer Part Number: AP2112K-1.8; Pin Count: 5; Case: SOT25; Mounted: Yes; Socket: No; SMD: Yes; Sense: No; ComponentHeight: 1.4mm; HelpURL: \\cern.ch\dfs\Applications\Altium\Datasheets\AP2112K-1.8TRG1.pdf; Author: CERN DEM JLC; CreateDate: 13.06.2018; LatestRevisionDate: 27.06.2022
L1 L2 = IND0805_TDK_MPZ2012S221A: Part Description: SMT Chip Bead for General Power Line (MPZ Series); Manufacturer: TDK; Power: 3A; Resistance: 0.04R; Tolerance: ±25%; Part Number: IND0805_TDK_MPZ2012S221A; Component Kind: Standard; Component Type: Standard; Pin Count: 2; Value: 220R@100MHz; Manufacturer Part Number: MPZ2012S221A; Case: 0805; Mounted: Yes; Socket: No; SMD: Yes; Sense: No; ComponentHeight: 1.05mm; HelpURL: \\cern.ch\dfs\Applications\Altium\Datasheets\IND0805_TDK_MPZ2012.pdf; Author: CERN DEM HF; CreateDate: 04.10.2021; LatestRevisionDate: 04.10.2021
R1-R3 R9 R118 = R0805_510R_0.1%_0.125W_10PPM: Resistor - 0.1%; Part Description: Thin Film Chip Resistor; Manufacturer: GENERIC; Manufacturer1 Part Number: RT0805BRB07510RL; Power: 0.125W; TC: ±10ppm; PressFit: No; Part Number: R0805_510R_0.1%_0.125W_10PPM; Component Kind: Standard; Component Type: Standard; Pin Count: 2; Value: 510; Status: Not Recommended; Manufacturer Part Number: R0805_510R_0.1%_0.125W_10PPM; Case: 0805; Mounted: Yes; Sense: No; Socket: No; SMD: Yes; Manufacturer1 Example: YAGEO PHYCOMP; Manufacturer1 ComponentHeight: 0.6mm; HelpURL: \\cern.ch\dfs\Applications\Altium\Datasheets\R0805_YAGEO_RT.pdf; Author: CERN DEM HF; CreateDate: 11.07.2022; LatestRevisionDate: 11.07.2022
R10 R115-R117 R119 R120 = R0805_51R_1%_0.125W_100PPM: Resistor - 1%; Part Description: General Purpose Thick Film Chip Resistor; Manufacturer: GENERIC; Manufacturer1 Part Number: NRC10F51R0TRF; Power: 0.125W; TC: ±100ppm/°C; PressFit: No; Part Number: R0805_51R_1%_0.125W_100PPM; Component Kind: Standard; Component Type: Standard; Pin Count: 2; Value: 51; Status: Preferred; Manufacturer Part Number: R0805_51R_1%_0.125W_100PPM; Case: 0805; Mounted: Yes; Sense: No; Socket: No; SMD: Yes; Manufacturer1 Example: NIC COMPONENT; Manufacturer1 ComponentHeight: 0.6mm; HelpURL: \\cern.ch\dfs\Applications\Altium\Datasheets\R0805_NIC_NRC.pdf; Author: CERN DEM JLC; CreateDate: 03.12.2007; LatestRevisionDate: 13.03.2008
R74-R77 = R0402_330R_1%_0.0625W_100PPM: Resistor - 1%; Part Description: General Purpose Thick Film Chip Resistor; Manufacturer: GENERIC; Manufacturer1 Part Number: 232270673301L; TC: ±100ppm/°C; PressFit: No; Part Number: R0402_330R_1%_0.0625W_100PPM; Component Kind: Standard; Component Type: Standard; Pin Count: 2; Value: 330; Status: Not Recommended; Power: 0.0625W; Manufacturer Part Number: R0402_330R_1%_0.0625W_100PPM; Case: 0402; Mounted: Yes; Sense: No; Socket: No; SMD: Yes; Manufacturer1 Example: YAGEO PHYCOMP; Manufacturer1 ComponentHeight: 0.4mm; HelpURL: \\cern.ch\dfs\Applications\Altium\Datasheets\R0402_Phycomp_RC0402.pdf; Author: CERN DEM JLC; CreateDate: 03.12.2007; LatestRevisionDate: 17.10.2012
TP7 TP9-TP11 = SMD_PAD_D0.6MM: Test Point; Part Description: 0.6mm Diameter SMD Pad; Mounted: No; Part Number: SMD_PAD_D0.6MM; Component Kind: Standard (No BOM); Component Type: Standard (No BOM); Pin Count: 1; Family: SMD Pad; Socket: No; SMD: Yes; Sense: No; Status: None; ComponentHeight: 0mm; HelpURL: Undefined; Author: CERN DEM HF; CreateDate: 22.11.2023; LatestRevisionDate: 22.11.2023; PackageDescription: 0.6mm Diameter SMD Pad
U1 = CMP-0327-00232-3: 2.0 Gbps 4 x 4 Crosspoint Switch with CML, LVDS, LVPECL Input and LVDS Output, 4 Tx and 4 Rx, -40 to +85 degC, 38-pin TSSOP (DBT), Green (RoHS & no Sb/Br); Part-to-Part Skew(Max)(ps): 300; Manufacturer: Texas Instruments; No. of Tx: 4; SubFamily: Crosspoint-Switch (>1Gbps); Crosspoint-Switch: TRUE; Signaling Rate(Mbps): 2000; ESD HBM(kV): 3; ICC(Max)(mA): 145; Peak-to-Peak Jitter(Max)(ps): 110; ComponentLink1URL: http://www.ti.com/; Mounting Technology: Surface Mount; ComponentLink3Description: URL Link1; ComponentLink2URL: http://www.ti.com/general/docs/lit/getliterature.tsp?genericPartNumber=SN65LVDS250&fileType=pdf; PackageDescription: 38-Pin Plastic Small Outline 0.5 mm Pitch; DatasheetVersion: SLLS594B; ComponentLink3URL: SamplesURL:http://www.ti.com/product/sn65lvds250#samples; Eco-Plan: Green (RoHS & no Sb/Br); Output Signal: LVDS; PartNumber: SN65LVDS250DBTR; Function: Crosspoint; ComponentLink2Description: Datasheet; Input Signal: CML, LVDS, LVPECL; PackageReference: DBT0038A; No. of Rx: 4; ComponentLink1Description: Manufacturer URL; PackageVersion: revI, Mar-2011
X4 = SAMTEC_DW-08-09-L-S-470: Connector 8 Male; Part Description: 8 Contacts, Pitch 2.54mm, Single Row Straight .Flex Stack, Flexible Board Stacker (Stacker Height = 11,938mm); Manufacturer: SAMTEC; PressFit: No; Part Number: SAMTEC_DW-08-09-L-S-470; Component Kind: Standard; Component Type: Standard; Pin Count: 8; Family: Header 8; Mounted: Yes; Socket: No; SMD: No; Sense: No; Status: None; Manufacturer Part Number: DW-08-09-L-S-470; ComponentHeight: 15.75mm; HelpURL: \\cern.ch\dfs\Applications\Altium\Datasheets\SAMTEC_DW.pdf; Author: CERN DEM HF; CreateDate: 06.06.2024; LatestRevisionDate: 06.06.2024